# Altium schematic sheet AT25SF081-SSHD.schdoc
size 58 x 37 mm
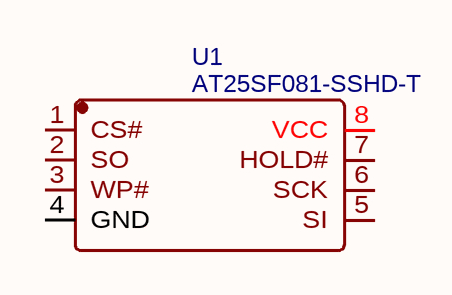
[diagram p0: AT25SF081-SSHD.schdoc]

## Parts
U1  AT25SF081-SSHD-T  [SOIC-8_L5.0-W4.0-P1.27-LS6.0-BL]

## Nets

Not connected (* = marked no-connect by the designer): U1 1(CS#) 2(SO) 3(WP#) 4(GND) 5(SI) 6(SCK) 7(HOLD#) 8(VCC)

## Library data of the parts
U1 = AT25SF081-SSHD-T: BOM_Manufacturer: Adesto Technologies; Contributor: LCSC; BOM_Supplier: LCSC; BOM_Supplier Part: C161756; BOM_Manufacturer Part: AT25SF081-SSHD-T; spicePre: U; spiceSymbolName: AT25SF081-SSHD-T